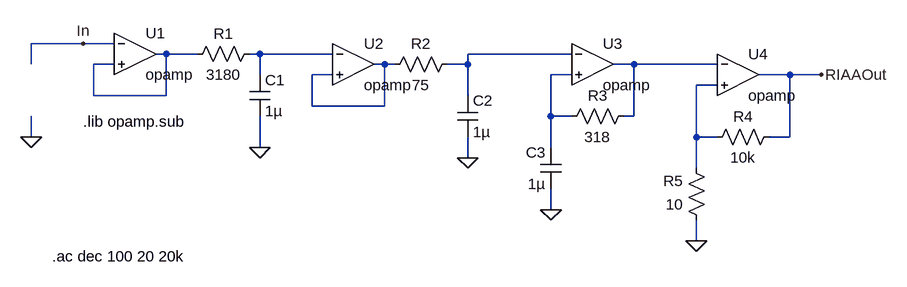
[diagram p0: schematic RIAAIdeal.asc]
RIAAIdeal.asc, the LTspice schematic file:
Version 4
SHEET 1 1236 680
WIRE -48 112 -128 112
WIRE 0 112 -48 112
WIRE 80 128 64 128
WIRE 128 128 80 128
WIRE 224 128 208 128
WIRE 336 128 224 128
WIRE 704 128 544 128
WIRE -128 144 -128 112
WIRE 0 144 -32 144
WIRE 416 144 400 144
WIRE 432 144 416 144
WIRE 544 144 544 128
WIRE 544 144 512 144
WIRE 800 144 768 144
WIRE 928 144 800 144
WIRE 224 160 224 128
WIRE 336 160 304 160
WIRE 704 160 672 160
WIRE 1040 160 992 160
WIRE 1088 160 1040 160
WIRE 928 176 896 176
WIRE -32 192 -32 144
WIRE 80 192 80 128
WIRE 80 192 -32 192
WIRE 544 192 544 144
WIRE 304 208 304 160
WIRE 416 208 416 144
WIRE 416 208 304 208
WIRE 672 224 672 160
WIRE 704 224 672 224
WIRE 800 224 800 144
WIRE 800 224 784 224
WIRE -128 256 -128 224
WIRE 896 256 896 176
WIRE 928 256 896 256
WIRE 1040 256 1040 160
WIRE 1040 256 1008 256
WIRE 224 272 224 224
WIRE 672 272 672 224
WIRE 544 288 544 256
WIRE 896 304 896 256
WIRE 672 368 672 336
WIRE 896 416 896 384
FLAG 896 416 0
FLAG 224 272 0
FLAG 544 288 0
FLAG 672 368 0
FLAG 1088 160 RIAAOut
FLAG -48 112 In
FLAG -128 256 0
SYMBOL Opamps\\opamp 32 64 R0
SYMATTR InstName U1
SYMBOL Opamps\\opamp 368 80 R0
SYMATTR InstName U2
SYMATTR SpiceLine2 GBW=1000Meg
SYMBOL Opamps\\opamp 736 80 R0
SYMATTR InstName U3
SYMATTR SpiceLine2 GBW=1000Meg
SYMBOL res 224 112 R90
WINDOW 0 0 56 VBottom 2
WINDOW 3 32 56 VTop 2
SYMATTR InstName R1
SYMATTR Value 3180
SYMBOL cap 208 160 R0
SYMATTR InstName C1
SYMATTR Value 1µ
SYMBOL Opamps\\opamp 960 96 R0
SYMATTR InstName U4
SYMATTR SpiceLine2 GBW=1000Meg
SYMATTR SpiceLine Aol=1000K
SYMBOL res 528 128 R90
WINDOW 0 0 56 VBottom 2
WINDOW 3 32 56 VTop 2
SYMATTR InstName R2
SYMATTR Value 75
SYMBOL res 688 240 R270
WINDOW 0 32 56 VTop 2
WINDOW 3 0 56 VBottom 2
SYMATTR InstName R3
SYMATTR Value 318
SYMBOL res 1024 240 R90
WINDOW 0 0 56 VBottom 2
WINDOW 3 32 56 VTop 2
SYMATTR InstName R4
SYMATTR Value 10k
SYMBOL res 912 400 R180
WINDOW 0 36 76 Left 2
WINDOW 3 36 40 Left 2
SYMATTR InstName R5
SYMATTR Value 10
SYMBOL cap 528 192 R0
SYMATTR InstName C2
SYMATTR Value 1µ
SYMBOL cap 688 336 R180
WINDOW 0 24 56 Left 2
WINDOW 3 24 8 Left 2
SYMATTR InstName C3
SYMATTR Value 1µ
TEXT -48 232 Left 2 !.lib opamp.sub
TEXT -96 440 Left 2 !.ac dec 100 20 20k

The netlist it stands for:
* RIAAIdeal.asc
XU1 In N001 N001 opamp Aol=100K GBW=10Meg  ; pins invin noninvin out
XU2 N002 N004 N004 opamp Aol=100K GBW=1000Meg  ; pins invin noninvin out
XU3 N003 N006 N005 opamp Aol=100K GBW=1000Meg  ; pins invin noninvin out
R1 N002 N001 3180
C1 N002 0 1µ
XU4 N005 N007 RIAAOut opamp Aol=1000K GBW=1000Meg  ; pins invin noninvin out
R2 N003 N004 75
R3 N006 N005 318
R4 RIAAOut N007 10k
R5 0 N007 10
C2 N003 0 1µ
C3 0 N006 1µ
.lib opamp.sub
.ac dec 100 20 20k
.backanno
.end